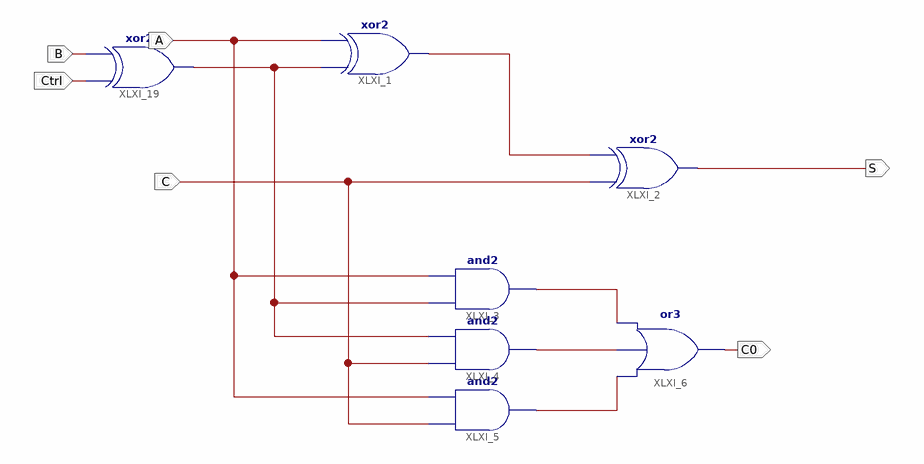
[diagram p0: schematic sheet 1]
// Xilinx ISE schematic AddSub1b.sch (kintex7) as structural Verilog: 7 symbols, 6 ports
module AddSub1b (
  input  C,
  input  A,
  input  B,
  input  Ctrl,
  output C0,
  output S
);

  wire XLXN_10, XLXN_11, XLXN_15, XLXN_16, XLXN_39;

  or XLXI_6 (C0, XLXN_15, XLXN_11, XLXN_10);
  and XLXI_5 (XLXN_15, C, A);
  and XLXI_4 (XLXN_11, C, XLXN_39);
  and XLXI_3 (XLXN_10, XLXN_39, A);
  xor XLXI_2 (S, C, XLXN_16);
  xor XLXI_1 (XLXN_16, XLXN_39, A);
  xor XLXI_19 (XLXN_39, Ctrl, B);
endmodule
